# Altium schematic sheet isoSPI_to_SPI.SchDoc
size A4
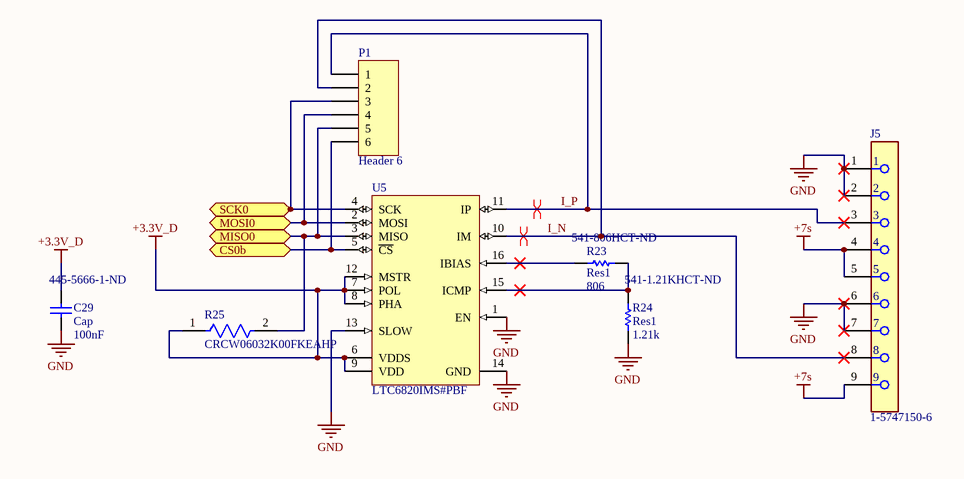
[diagram p0: isoSPI_to_SPI.SchDoc]

## Parts
C29  Cap  value 100nF  Supplier Part Number 1: 445-5666-1-ND  [J1-0603]
J5  1-5747150-6  [FP-1-5747150-6-MFG]
P1  Header 6  [HDR1X6]
R23  Res1  value 806  Supplier Part Number 1: 541-806HCT-ND  [J1-0603]
R24  Res1  value 1.21k  Supplier Part Number 1: 541-1.21KHCT-ND  [J1-0603]
R25  CRCW06032K00FKEAHP  [FP-CRCW0603-HPe3-IPC_C]
U5  LTC6820IMS#PBF  [LT-MS-16_M]

## Ports
CS0b (bidir), MISO0 (bidir), MOSI0 (bidir), SCK0 (bidir)

## Nets
+3.3V_D: C29.2 R25.1 U5.6(VDDS) U5.7(POL) U5.8(PHA) U5.9(VDD) U5.12(MSTR)
+7s: J5.4 J5.5 J5.9
GND: C29.1 J5.1 J5.2 J5.6 J5.7 R24.1 U5.1(EN) U5.13(SLOW) U5.14(GND)
CS0b: P1.6 U5.5(~{CS}) ; port CS0b
I_N: J5.8 P1.2 U5.10(IM)
I_P: J5.3 P1.1 U5.11(IP)
MISO0: P1.5 R25.2 U5.3(MISO) ; port MISO0
MOSI0: P1.4 U5.2(MOSI) ; port MOSI0
SCK0: P1.3 U5.4(SCK) ; port SCK0
NetR23_1: R23.1 U5.16(IBIAS)
NetR23_2: R23.2 R24.2 U5.15(ICMP)

## Layout directives
differential pair: I_N, I_P

## Library data of the parts
C29 = Cap: TDK - CGA3E2X7R1H104K080AA. - CERAMIC CAPACITOR, 0.1UF, 50V, X7R, 0603, FULL REEL; Tolerance: 10%; Published: 8-Jun-2000; LatestRevisionDate: 17-Jul-2002; LatestRevisionNote: Re-released for DXP Platform.; PackageReference: RAD-0.3; Publisher: Altium Limited; PackageDescription: Radial Cap, Thru-Hole; 2 Leads; 0.3 in Pin Spacing; Supplier 1: Digi-Key; Manufacturer: TDK; Manufacturer Part Number: CGA3E2X7R1H104K080AA; RoHS: Yes; Category: Ceramic Capacitors; Stock 1: 7293536; Pricing 1: 1=0.10000, 10=0.07600, 50=0.04160, 100=0.03400, 500=0.02426, 1000=0.01906 (USD); Mount: Surface Mount; Case/Package: 0603; Weight: 7.1E-05oz; Case Code (Imperial): 0603; Case Code (Metric): 1608; Min Operating Temperature: -55°C; Max Operating Temperature: 125°C; Capacitance: 100nF; Packaging: Tape and Reel; Package Quantity: 1; Voltage Rating: 50V; Dielectric: X7R; Voltage Rating (DC): 50V; Termination: SMD/SMT; Voltage: 50V; Composition: Ceramic; Length: 1.6mm; Height: 0.8mm; Width: 0.8mm; Depth: 0.8mm; Thickness: 0.035inch; Ratings: AEC-Q200; Radiation Hardening: No; REACH SVHC: No SVHC; Lead Free: Lead Free; ComponentLink1URL: https://datasheet.ciiva.com/24216/cga3e2x7r1h104k080aa-266291-24216208.pdf?src-supplier=Mouser; ComponentLink1Description: https://datasheet.ciiva.com/24216/cga3e2x7r1h104k080aa-266291-24216208.pdf?src-supplier=Mouser; ComponentLink2URL: https://datasheet.ciiva.com/15192/getdatasheetpartid-715867-15192412.pdf?src-supplier=Verical; ComponentLink2Description: https://datasheet.ciiva.com/15192/getdatasheetpartid-715867-15192412.pdf?src-supplier=Verical; ComponentLink3URL: https://datasheet.ciiva.com/16500/mlccspec-automotive-general-midvoltage-en-16500693.pdf?src-supplier=Future+Electronics; ComponentLink3Description: https://datasheet.ciiva.com/16500/mlccspec-automotive-general-midvoltage-en-16500693.pdf?src-supplier=Future+Electronics; ComponentLink4URL: https://datasheet.ciiva.com/22725/1735392-22725642.pdf?src-supplier=Element14; ComponentLink4Description: https://datasheet.ciiva.com/22725/1735392-22725642.pdf?src-supplier=Element14; ComponentLink5URL: https://datasheet.ciiva.com/23803/1936565-23803084.pdf?src-supplier=Newark; ComponentLink5Description: https://datasheet.ciiva.com/23803/1936565-23803084.pdf?src-supplier=Newark; ComponentLink6URL: https://datasheet.ciiva.com/46385/1735392-46385708.pdf?src-supplier=Element14; ComponentLink6Description: https://datasheet.ciiva.com/46385/1735392-46385708.pdf?src-supplier=Element14
J5 = CMP-03367-000009-1: CONN D-SUB RCPT 9POS VERT SOLDER; Manufacturer: TE Connectivity; Is Female: yes; Current Rating: 6A; Conn Orientation: Vertical; Conn Gender: Female; Shielding: false; Number Of Contacts: 9; Pitch: 2.74mm; ComponentLink2URL: https://www.te.com/usa-en/product-1-5747150-6.html?te_bu=Cor&te_type=other&te_campaign=oct_glo_cor-oct-global-oth-prtnr-fy19-oct-octo-buy-bom_sma-298_2&elqCampaignId=35216; Manufacturer Part Number: 1-5747150-6; Temperature: -55°C to +105°C; Mouser Description: D-Sub Standard Connectors RECP FRNT MTL SHL 9P female screwlocks; Octopart: https://octopart.com/1-5747150-6-te+connectivity-39500344; Category: Conn; Automotive: No; Package: 1-5747150-6; Device Class L3: unset; Contact Material: Gold,Nickel; Lead Free: Yes; Height: 12.54mm; RoHS: TRUE; ComponentLink2Description: Datasheet; Device Class L2: D-Sub Connectors; Device Class L1: Connectors; Digikey Description: CONN D-SUB RCPT 9POS VERT SOLDER; Temperature Range High: +105°C; Temperature Range Low: -55°C
P1 = Header 6: Header, 6-Pin; LatestRevisionDate: 17-Jul-2002; LatestRevisionNote: Re-released for DXP Platform.; Publisher: Altium Limited
R23 = Res1: RES SMD 806 OHM 1% 1/10W 0603; Manufacturer: Vishay; Manufacturer Part Number: CRCW0603806RFKEA; Resistance: 806R; Temperature Coefficient: 100ppm/°C; Power Rating: 100mW; Voltage Rating: 75V; Published: 8-Jun-2000; LatestRevisionDate: 17-Jul-2002; LatestRevisionNote: Re-released for DXP Platform.; PackageReference: AXIAL-0.3; Publisher: Altium Limited; PackageDescription: Axial Device, Thru-Hole; 2 Leads; 0.3 in Pin Spacing; Supplier 1: Digi-Key; RoHS: Yes; Category: Chip SMD Resistors; Stock 1: 15321; Pricing 1: 1=0.10000, 10=0.03300, 100=0.01340, 1000=0.00602, 2500=0.00522 (USD); Mount: Surface Mount; Case/Package: 0603; Weight: 7.1E-05oz; Case Code (Metric): 1608; Case Code (Imperial): 0603; Contact Plating: Tin; Min Operating Temperature: -55°C; Max Operating Temperature: 155°C; Packaging: Tape and Reel; Tolerance: 1%; Package Quantity: 10; Termination: SMD/SMT; Composition: Thick Film; Number of Terminations: 2; Max Power Dissipation: 100mW; Military Standard: Not; Features: Automotive AEC-Q200; Working Voltage: 75V; Length: 1.55mm; Height: 0.45mm; Width: 0.033inch; Depth: 0.85mm; Radiation Hardening: No; REACH SVHC: Unknown; ComponentLink1URL: https://datasheet.ciiva.com/11809/0900766b80d98afc-11809816.pdf?src-supplier=RSComponents; ComponentLink1Description: https://datasheet.ciiva.com/11809/0900766b80d98afc-11809816.pdf?src-supplier=RSComponents; ComponentLink2URL: https://datasheet.ciiva.com/2466/dcrcwe3-2466496.pdf?src-supplier=Digi-Key; ComponentLink2Description: https://datasheet.ciiva.com/2466/dcrcwe3-2466496.pdf?src-supplier=Digi-Key; ComponentLink3URL: https://datasheet.ciiva.com/15159/getdatasheetpartid-32773-15159334.pdf?src-supplier=Verical; ComponentLink3Description: https://datasheet.ciiva.com/15159/getdatasheetpartid-32773-15159334.pdf?src-supplier=Verical; ComponentLink4URL: https://datasheet.ciiva.com/7672/1697337-7672567.pdf?src-supplier=Element14; ComponentLink4Description: https://datasheet.ciiva.com/7672/1697337-7672567.pdf?src-supplier=Element14; ComponentLink5URL: https://datasheet.ciiva.com/16199/dcrcwe3-16199879.pdf?src-supplier=Future+Electronics; ComponentLink5Description: https://datasheet.ciiva.com/16199/dcrcwe3-16199879.pdf?src-supplier=Future+Electronics; ComponentLink6URL: https://datasheet.ciiva.com/3257/dcrcwe3-3257912.pdf?src-supplier=Avnet; ComponentLink6Description: https://datasheet.ciiva.com/3257/dcrcwe3-3257912.pdf?src-supplier=Avnet; ComponentLink7URL: https://datasheet.ciiva.com/7672/1697337-7672568.pdf?src-supplier=Element14; ComponentLink7Description: https://datasheet.ciiva.com/7672/1697337-7672568.pdf?src-supplier=Element14; ComponentLink8URL: https://datasheet.ciiva.com/3257/dcrcwe3-3257913.pdf?src-supplier=Avnet; ComponentLink8Description: https://datasheet.ciiva.com/3257/dcrcwe3-3257913.pdf?src-supplier=Avnet; ComponentLink9URL: https://datasheet.ciiva.com/16782/70201119-16782811.pdf?src-supplier=Allied+Electronics; ComponentLink9Description: https://datasheet.ciiva.com/16782/70201119-16782811.pdf?src-supplier=Allied+Electronics; ComponentLink10URL: https://datasheet.ciiva.com/16884/dcrcwe3-16884269.pdf?src-supplier=Avnet+Europe; ComponentLink10Description: https://datasheet.ciiva.com/16884/dcrcwe3-16884269.pdf?src-supplier=Avnet+Europe; ComponentLink11URL: https://datasheet.ciiva.com/2466/dcrcwe3-2466494.pdf?src-supplier=Digi-Key; ComponentLink11Description: https://datasheet.ciiva.com/2466/dcrcwe3-2466494.pdf?src-supplier=Digi-Key; ComponentLink12URL: https://datasheet.ciiva.com/5546/dcrcwe3-109170-5546782.pdf?src-supplier=Mouser; ComponentLink12Description: https://datasheet.ciiva.com/5546/dcrcwe3-109170-5546782.pdf?src-supplier=Mouser; ComponentLink13URL: https://datasheet.ciiva.com/2466/dcrcwe3-2466495.pdf?src-supplier=Digi-Key; ComponentLink13Description: https://datasheet.ciiva.com/2466/dcrcwe3-2466495.pdf?src-supplier=Digi-Key
R24 = Res1: Res Thick Film 0603 1.21K Ohm 1% 1/10W 100ppm/C Molded SMD Paper T/R; Manufacturer: Vishay; Manufacturer Part Number: CRCW06031K21FKEA; Power Rating: 100mW; Resistance: 1.21kR; Temperature Coefficient: 100ppm/°C; Voltage Rating: 75V; Published: 8-Jun-2000; LatestRevisionDate: 17-Jul-2002; LatestRevisionNote: Re-released for DXP Platform.; PackageReference: AXIAL-0.3; Publisher: Altium Limited; PackageDescription: Axial Device, Thru-Hole; 2 Leads; 0.3 in Pin Spacing; Supplier 1: Digi-Key; RoHS: Yes; Category: Chip SMD Resistors; Stock 1: 10304; Pricing 1: 1=0.10000, 10=0.03300, 100=0.01340, 1000=0.00602, 2500=0.00522 (USD); Mount: Surface Mount; Case/Package: 0603; Weight: 7.1E-05oz; Case Code (Metric): 1608; Case Code (Imperial): 0603; Contact Plating: Tin; Min Operating Temperature: -55°C; Max Operating Temperature: 155°C; Tolerance: 1%; Packaging: Tape and Reel; Composition: Thick Film; Voltage Rating (DC): 75V; Package Quantity: 10; Number of Terminations: 2; Military Standard: Not; Max Power Dissipation: 100mW; Termination: SMD/SMT; Features: Automotive AEC-Q200; Length: 1.55mm; Height: 0.45mm; Width: 0.033inch; Depth: 0.85mm; Radiation Hardening: No; REACH SVHC: Unknown; Lead Free: Lead Free; ComponentLink1URL: https://datasheet.ciiva.com/11811/0900766b80d98afc-11811488.pdf?src-supplier=RSComponents; ComponentLink1Description: https://datasheet.ciiva.com/11811/0900766b80d98afc-11811488.pdf?src-supplier=RSComponents; ComponentLink2URL: https://datasheet.ciiva.com/2466/dcrcwe3-2466209.pdf?src-supplier=Digi-Key; ComponentLink2Description: https://datasheet.ciiva.com/2466/dcrcwe3-2466209.pdf?src-supplier=Digi-Key; ComponentLink3URL: https://datasheet.ciiva.com/2466/dcrcwe3-2466210.pdf?src-supplier=Digi-Key; ComponentLink3Description: https://datasheet.ciiva.com/2466/dcrcwe3-2466210.pdf?src-supplier=Digi-Key; ComponentLink4URL: https://datasheet.ciiva.com/2466/dcrcwe3-2466211.pdf?src-supplier=Digi-Key; ComponentLink4Description: https://datasheet.ciiva.com/2466/dcrcwe3-2466211.pdf?src-supplier=Digi-Key; ComponentLink5URL: https://datasheet.ciiva.com/3257/dcrcwe3-3257157.pdf?src-supplier=Avnet; ComponentLink5Description: https://datasheet.ciiva.com/3257/dcrcwe3-3257157.pdf?src-supplier=Avnet; ComponentLink6URL: https://datasheet.ciiva.com/7690/1533075-7690856.pdf?src-supplier=Element14; ComponentLink6Description: https://datasheet.ciiva.com/7690/1533075-7690856.pdf?src-supplier=Element14; ComponentLink7URL: https://datasheet.ciiva.com/16213/dcrcwe3-16213112.pdf?src-supplier=Future+Electronics; ComponentLink7Description: https://datasheet.ciiva.com/16213/dcrcwe3-16213112.pdf?src-supplier=Future+Electronics; ComponentLink8URL: https://datasheet.ciiva.com/5541/dcrcwe3-109170-5541610.pdf?src-supplier=Mouser; ComponentLink8Description: https://datasheet.ciiva.com/5541/dcrcwe3-109170-5541610.pdf?src-supplier=Mouser; ComponentLink9URL: https://datasheet.ciiva.com/16764/70201119-16764972.pdf?src-supplier=Allied+Electronics; ComponentLink9Description: https://datasheet.ciiva.com/16764/70201119-16764972.pdf?src-supplier=Allied+Electronics
R25 = CMP-2000-03160-2: RES Thick Film, 2kΩ, 1%, 0.33W, 100ppm/°C, 0603; Max Power Dissipation: 250mW; Voltage Rating: 75V; Resistance: 2kR; Radiation Hardening: No; Min Operating Temperature: -55°C; Features: Automotive AEC-Q200; Tolerance: 1%; Width: 0.033inch; Military Standard: Not; Weight: 7.1E-05oz; Lead Free: Lead Free; Length: 1.6mm; Package Quantity: 10; Composition: Thick Film; Mount: Surface Mount; Depth: 0.85mm; Case Code (Metric): 1608; Case Code (Imperial): 0603; Max Operating Temperature: 155°C; Power Rating: 250mW; Termination: Solder; Height: 0.45mm; Temperature Coefficient: 100ppm/°C; Packaging: Tape and Reel; Case/Package: 0603; Contact Plating: Tin; Number of Terminations: 2
U5 = CMP-0937-00012-1: IsoSPI Isolated Communication Interface, 2.7 to 5.5 V, -40 to 85 degC, 16-Pin MSOP (MS), Pb-Free; Manufacturer: Linear Technology; Receiver Input Resistance: 35 kOhm; IO Supply Current: 1 uA Max.; Supply Current, IDLE State: 2 uA; IO Supply Voltage Range: 1.7 to 5.5 V; VBIAS: 1.9 to 2.1 V; ComponentLink3Description: Package Specification; PackageDescription: 16-Pin Micro Small Outline Package, Body 4.039 x 3 mm, Pitch 0.5 mm; PackageVersion: Rev. A; Temperature Range (degC): -40 to 85; PackageReference: MS-16; DatasheetVersion: Rev. A; ComponentLink2URL: http://cds.linear.com/docs/en/datasheet/6820fa.pdf; Power Supply: 2.7 to 5.5 V; Mounting Technology: Surface Mount; ComponentLink1URL: http://www.linear.com/; ComponentLink3URL: http://cds.linear.com/docs/en/packaging/05081669_A_MS16.pdf; PartNumber: LTC6820IMS#PBF; ComponentLink2Description: Datasheet; ComponentLink1Description: Manufacturer URL